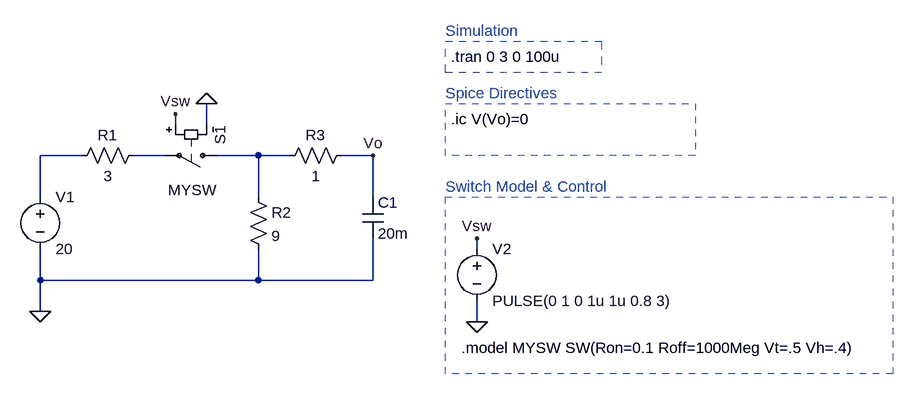
[diagram p0: schematic Switch_Option_1.asc]
Switch_Option_1.asc, the LTspice schematic file:
Version 4
SHEET 1 1532 760
WIRE 224 192 224 176
WIRE 272 192 272 160
WIRE 80 240 16 240
WIRE 208 240 160 240
WIRE 352 240 288 240
WIRE 400 240 352 240
WIRE 528 240 480 240
WIRE 16 304 16 240
WIRE 352 304 352 240
WIRE 528 304 528 240
WIRE 688 384 688 368
WIRE 16 432 16 384
WIRE 352 432 352 384
WIRE 352 432 16 432
WIRE 528 432 528 368
WIRE 528 432 352 432
WIRE 16 480 16 432
WIRE 688 496 688 464
FLAG 16 480 0
FLAG 272 160 0
FLAG 224 176 Vsw
FLAG 688 368 Vsw
FLAG 688 496 0
FLAG 528 240 Vo
SYMBOL voltage 16 288 R0
SYMATTR InstName V1
SYMATTR Value 20
SYMBOL sw 304 240 R90
WINDOW 0 -46 11 Left 2
WINDOW 3 53 17 VRight 2
SYMATTR InstName S1
SYMATTR Value MYSW
SYMBOL voltage 688 368 R0
WINDOW 123 0 0 Left 0
WINDOW 39 0 0 Left 0
SYMATTR InstName V2
SYMATTR Value PULSE(0 1 0 1u 1u 0.8 3)
SYMBOL res 176 224 R90
WINDOW 0 0 56 VBottom 2
WINDOW 3 32 56 VTop 2
SYMATTR InstName R1
SYMATTR Value 3
SYMBOL res 336 288 R0
SYMATTR InstName R2
SYMATTR Value 9
SYMBOL res 496 224 R90
WINDOW 0 0 56 VBottom 2
WINDOW 3 32 56 VTop 2
SYMATTR InstName R3
SYMATTR Value 1
SYMBOL cap 512 304 R0
SYMATTR InstName C1
SYMATTR Value 20m
TEXT 640 48 Left 2 ;Simulation
TEXT 648 88 Left 2 !.tran 0 3 0 100u
TEXT 640 144 Left 2 ;Spice Directives
TEXT 664 536 Left 2 !.model MYSW SW(Ron=0.1 Roff=1000Meg Vt=.5 Vh=.4)
TEXT 648 184 Left 2 !.ic V(Vo)=0
TEXT 640 288 Left 2 ;Switch Model & Control
RECTANGLE Normal 1024 240 640 160 2
RECTANGLE Normal 880 112 640 64 2
RECTANGLE Normal 1328 576 640 304 2

The netlist it stands for:
* Switch_Option_1.asc
V1 N001 0 20
S1 N003 N002 Vsw 0 MYSW
V2 Vsw 0 PULSE(0 1 0 1u 1u 0.8 3)
R1 N002 N001 3
R2 N003 0 9
R3 Vo N003 1
C1 Vo 0 20m
* Simulation
.tran 0 3 0 100u
* Spice Directives
.model MYSW SW(Ron=0.1 Roff=1000Meg Vt=.5 Vh=.4)
.ic V(Vo)=0
* Switch Model & Control
.backanno
.end